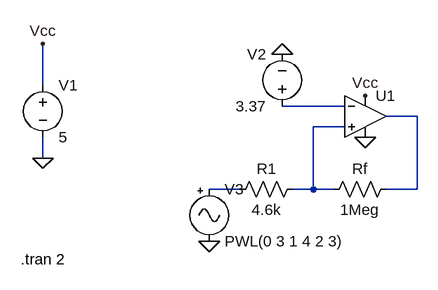
[diagram p0: schematic Draft1.asc]
Draft1.asc, the LTspice schematic file:
Version 4
SHEET 1 880 680
WIRE 32 64 32 0
WIRE 496 96 400 96
WIRE 608 112 560 112
WIRE 496 128 448 128
WIRE 32 176 32 144
WIRE 336 224 288 224
WIRE 448 224 448 128
WIRE 448 224 416 224
WIRE 480 224 448 224
WIRE 608 224 608 112
WIRE 608 224 560 224
FLAG 32 176 0
FLAG 32 0 Vcc
FLAG 528 144 0
FLAG 528 80 Vcc
FLAG 400 16 0
FLAG 288 304 0
SYMBOL voltage 32 48 R0
SYMATTR InstName V1
SYMATTR Value 5
SYMBOL OpAmps\\UniversalOpAmp2 528 112 R0
SYMATTR InstName U1
SYMBOL res 576 208 R90
WINDOW 0 0 56 VBottom 2
WINDOW 3 32 56 VTop 2
SYMATTR InstName Rf
SYMATTR Value 1Meg
SYMBOL res 432 208 R90
WINDOW 0 0 56 VBottom 2
WINDOW 3 32 56 VTop 2
SYMATTR InstName R1
SYMATTR Value 4.6k
SYMBOL voltage 400 112 R180
WINDOW 0 24 96 Left 2
WINDOW 3 24 16 Left 2
WINDOW 123 0 0 Left 0
WINDOW 39 0 0 Left 0
SYMATTR InstName V2
SYMATTR Value 3.37
SYMBOL Misc\\signal 288 208 R0
WINDOW 123 0 0 Left 0
WINDOW 39 0 0 Left 0
SYMATTR InstName V3
SYMATTR Value PWL(0 3 1 4 2 3)
TEXT -2 332 Left 2 !.tran 2

The netlist it stands for:
* Draft1.asc
V1 Vcc 0 5
XU1 N003 N001 Vcc 0 N002 level2 Avol=1Meg GBW=10Meg Slew=10Meg Ilimit=25m Rail=0 Vos=0 En=0 Enk=0 In=0 Ink=0 Rin=500Meg  ; pins In+ In- V+ V- OUT
Rf N002 N003 1Meg
R1 N003 N004 4.6k
V2 N001 0 3.37
V3 N004 0 PWL(0 3 1 4 2 3)
.tran 2
.lib UniversalOpAmp2.lib
.backanno
.end